# EAGLE design controler_bot_3_52 (EAGLE 5.04)
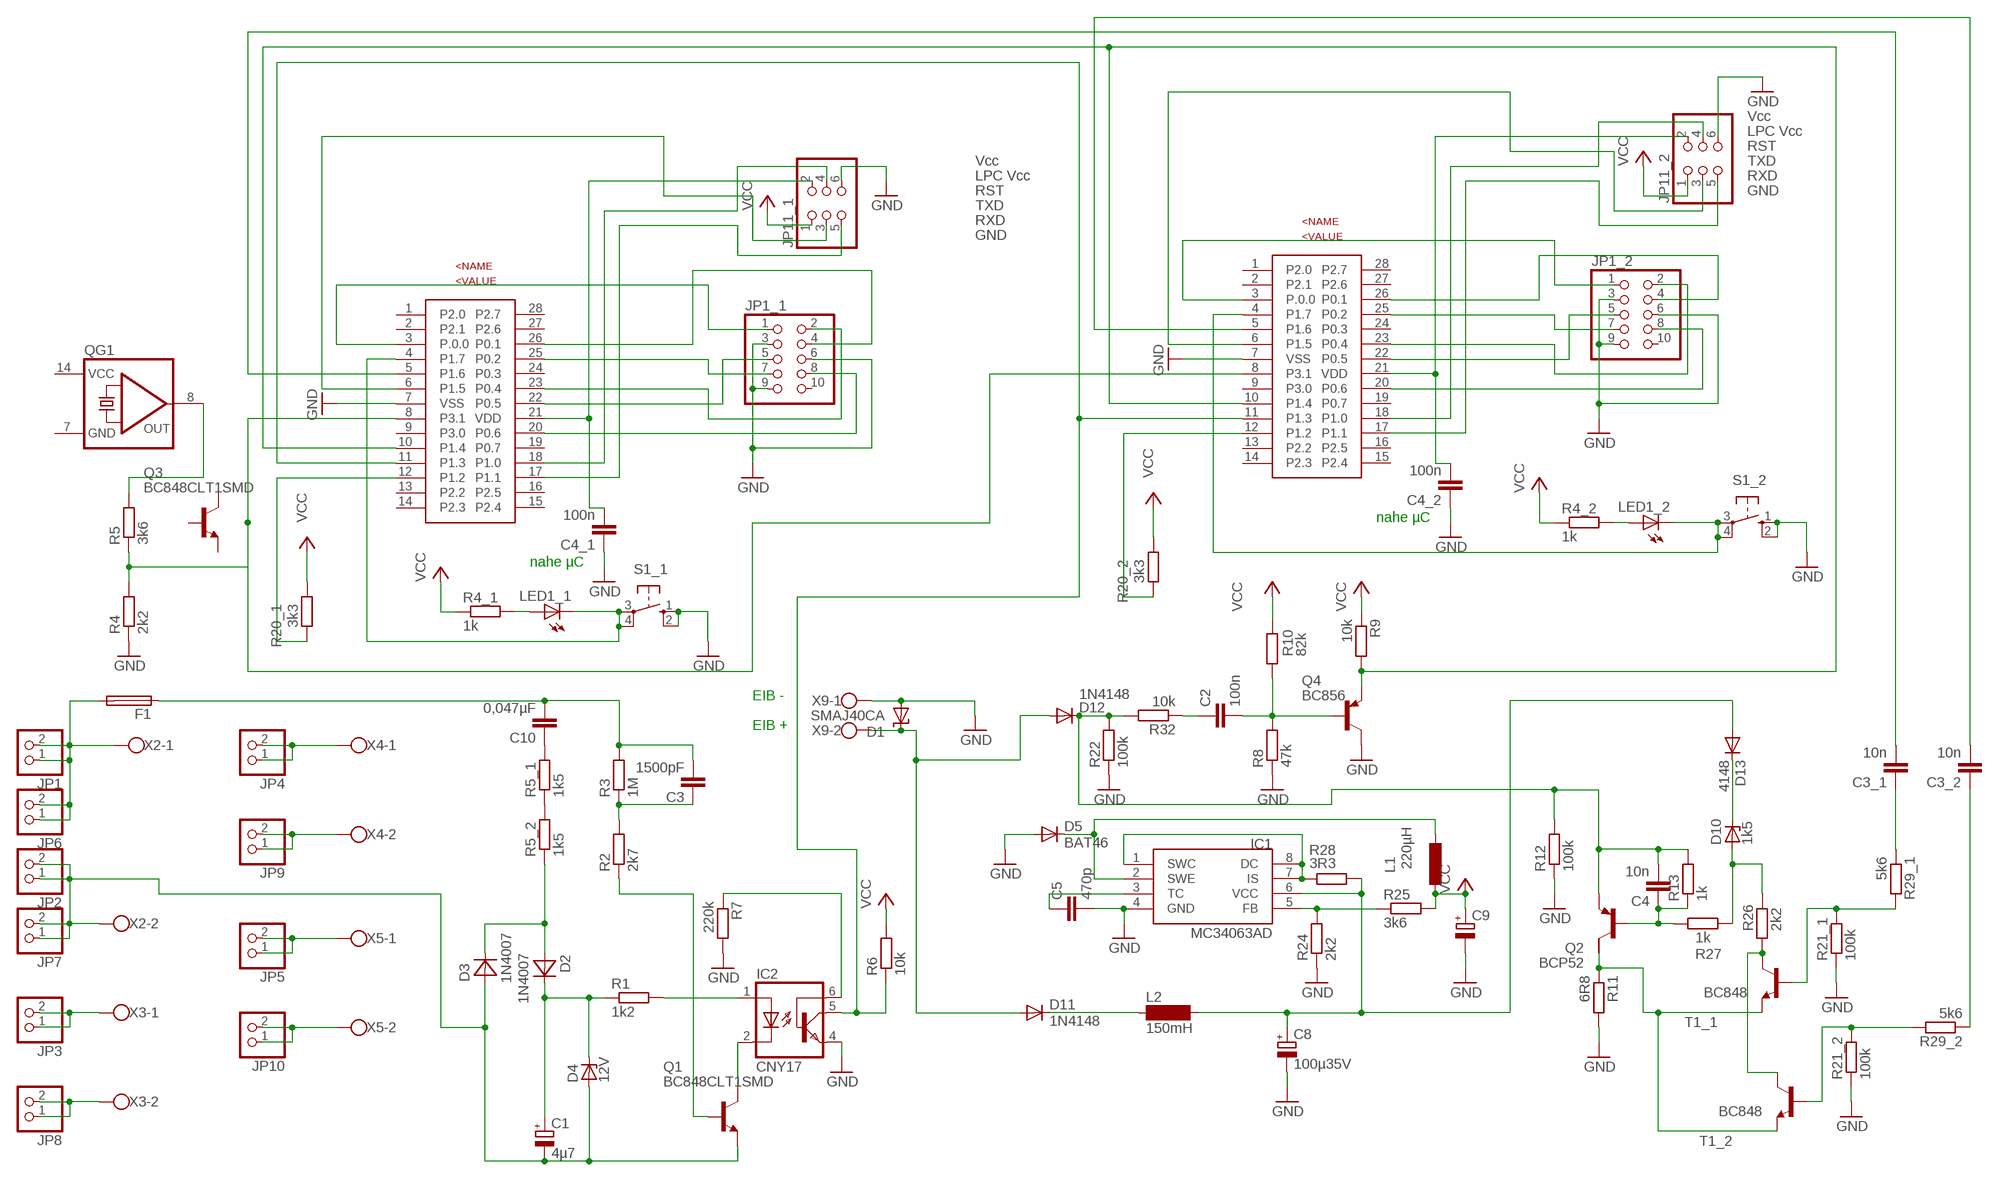
[diagram p0: schematic, sheet 1]

## Parts
C1  4µ7  CPOL-EUE2-5  [E2-5]
C2  100n  C-EUC1206  [C1206]
C3  1500pF  C-EU102-043X133  [C102-043X133]
C3_1  10n  C-EUC1206  [C1206]
C3_2  10n  C-EUC1206  [C1206]
C4  10n  C-EUC1206  [C1206]
C4_1  100n  C-EUC1206  [C1206]
C4_2  100n  C-EUC1206  [C1206]
C5  470p  C-EUC1206  [C1206]
C8  100µ35V  CPOL-EUE3.5-8  [E3,5-8]
C9  CPOL-EUE2.5-5  [E2,5-5]
C10  0,047µF  C-EU102-064X133  [C102-064X133]
D1  SMAJ40CA  SUPPRESSOR-SMBJ  [SMBJ]
D2  1N4007  [DO41-7]
D3  1N4007  [DO41-7]
D4  12V  ZENER-DIODESMB  [SMB]
D5  BAT46  DIODE-MINIMELF  [MINIMELF]
D10  1k5  ZPD  [MINIMELF]
D11  1N4148  DIODE-MINIMELF  [MINIMELF]
D12  1N4148  DIODE-MINIMELF  [MINIMELF]
D13  4148  DIODE-MINIMELF  [MINIMELF]
F1  19560  [19560]
IC1  MC34063AD  [SOIC8]
IC2  CNY17  [DIL06]
JP1  PINHD-1X2  [1X02]
JP1_1  PINHD-2X5  [2X05]
JP1_2  PINHD-2X5  [2X05]
JP2  PINHD-1X2  [1X02]
JP3  PINHD-1X2  [1X02]
JP4  PINHD-1X2  [1X02]
JP5  PINHD-1X2  [1X02]
JP6  PINHD-1X2  [1X02]
JP7  PINHD-1X2  [1X02]
JP8  PINHD-1X2  [1X02]
JP9  PINHD-1X2  [1X02]
JP10  PINHD-1X2  [1X02]
JP11_1  PINHD-2X3  [2X03]
JP11_2  PINHD-2X3  [2X03]
L1  220µH  L-EU2200-11.43  [2200-11.43]
L2  150mH  BS11  [BS11]
LED1_1  LED3MM  [LED3MM]
LED1_2  LED3MM  [LED3MM]
Q1  BC848CLT1SMD  [SOT23]
Q2  BCP52  FZT753SMD  [SOT223]
Q3  BC848CLT1SMD  [SOT23]
Q4  BC856  BC856ALT1SMD  [SOT23-BEC]
QG1  QG5860  [DIL14S]
R1  1k2  R-EU_R1206  [R1206]
R2  2k7  R-EU_0207/10  [0207/10]
R3  1M  R-EU_0207/7  [0207/7]
R4  2k2  R-EU_R1206  [R1206]
R4_1  1k  R-EU_R1206  [R1206]
R4_2  1k  R-EU_R1206  [R1206]
R5  3k6  R-EU_M1206  [M1206]
R5_1  1k5  R-EU_R1206  [R1206]
R5_2  1k5  R-EU_R1206  [R1206]
R6  10k  R-EU_R1206  [R1206]
R7  220k  R-EU_R1206  [R1206]
R8  47k  R-EU_M1206  [M1206]
R9  10k  R-EU_R1206  [R1206]
R10  82k  R-EU_R1206  [R1206]
R11  6R8  R-EU_R1206  [R1206]
R12  100k  R-EU_M1206  [M1206]
R13  1k  R-EU_R1206  [R1206]
R20_1  3k3  R-EU_M1206  [M1206]
R20_2  3k3  R-EU_M1206  [M1206]
R21_1  100k  R-EU_R1206  [R1206]
R21_2  100k  R-EU_R1206  [R1206]
R22  100k  R-EU_M1206  [M1206]
R24  2k2  R-EU_R1206  [R1206]
R25  3k6  R-EU_M1206  [M1206]
R26  2k2  R-EU_M1206  [M1206]
R27  1k  R-EU_R1206  [R1206]
R28  3R3  R-EU_M1206  [M1206]
R29_1  5k6  R-EU_R1206  [R1206]
R29_2  5k6  R-EU_R1206  [R1206]
R32  10k  R-EU_R1206  [R1206]
S1_1  10-XX  [B3F-10XX]
S1_2  10-XX  [B3F-10XX]
T1_1  BC848  [SOT23]
T1_2  BC848  [SOT23]
U1_1  LPC936TSSOP28  [TSSOP28]
U1_2  LPC936TSSOP28  [TSSOP28]
X2  W237-02P  [W237-132]
X3  W237-02P  [W237-132]
X4  W237-02P  [W237-132]
X5  W237-02P  [W237-132]
X9  W237-102  [W237-102]

## Nets
DRAIN: R26.1 T1_1.3(C) T1_2.3(C)
EIB+: D1.C D11.A D12.A X9.2
EIB_DC: C8.+ D13.A IC1.6(VCC) L2.2 R28.2
EIBIN: Q4.E R9.2 U1_1.10(P1.4) U1_2.10(P1.4)
GATE: R21_1.2 R29_1.2 T1_1.1(B)
GATE1: R21_2.2 R29_2.2 T1_2.1(B)
GND: C4_1.1 C4_2.1 C5.2 C8.- C9.- D1.A D5.A IC1.4(GND) IC2.4(EMI) JP1_1.3 JP1_1.6 JP1_1.9 JP1_2.3 JP1_2.6 JP1_2.9 JP11_1.6 JP11_2.6 Q4.C R4.1 R7.2 R8.1 R11.2 R12.1 R21_1.1 R21_2.1 R22.1 R24.1 S1_1.1(S) S1_1.2(S1) S1_2.1(S) S1_2.2(S1) U1_1.7(VSS) U1_2.7(VSS) X9.1
N$1: F1.2 JP1.1 JP1.2 JP6.1 JP6.2 X2.1
N$2: C1.- D3.A D4.A JP2.1 JP2.2 JP7.1 JP7.2 Q1.2(E) X2.2
N$3: JP4.1 JP4.2 X4.1
N$4: D11.C L2.1
N$5: LED1_2.A R4_2.2
N$6: C4.2 D12.C Q2.3(E) R12.2 R13.2 R22.2 R32.2
N$7: JP9.1 JP9.2 X4.2
N$8: JP5.1 JP5.2 X5.1
N$9: JP10.1 JP10.2 X5.2
N$10: C10.1 R5_1.2
N$11: C1.+ D2.C D4.C R1.1
N$12: LED1_1.A R4_1.2
N$13: IC2.1(A) R1.2
N$14: IC2.2(C) Q1.3(C)
N$15: C3.1 R2.2 R3.1
N$16: QG1.8(OUT) R5.2
N$17: R5_1.1 R5_2.2
N$18: C4.1 Q2.1(B) R13.1 R27.2
N$19: R4.2 R5.1 U1_1.8(P3.1) U1_2.8(P3.1)
N$20: IC2.5(COL) R6.1 U1_1.11(P1.3) U1_2.11(P1.3)
N$21: JP3.1 JP3.2 X3.1
N$22: JP8.1 JP8.2 X3.2
N$23: C3_1.1 R29_1.1
N$24: Q2.2(C) R11.1 T1_1.2(E) T1_2.2(E)
N$25: C3.2 C10.2 F1.1 R3.2
N$26: C3_2.1 R29_2.1
N$27: C3_1.2 U1_1.5(P1.6)
N$28: C3_2.2 U1_2.5(P1.6)
N$29: JP11_2.5 U1_2.17(P1.1)
N$30: JP11_2.4 U1_2.18(P1.0)
N$31: C2.2 Q4.B R8.2 R10.1
N$32: D2.A D3.C R5_2.1
N$33: IC2.6(BAS) R7.1
N$34: Q1.1(B) R2.1
N$41: JP11_1.5 U1_1.17(P1.1)
N$43: JP11_1.4 U1_1.18(P1.0)
N$50: IC1.5(FB) R24.2 R25.1
N$51: D5.C IC1.2(SWE) L1.2
N$52: C5.1 IC1.3(TC)
N$55: D10.A R26.2 R27.1
N$58: D10.C D13.C
N$63: IC1.1(SWC) IC1.7(IS) IC1.8(DC) R28.1
N$77: C2.1 R32.1
P0.0: JP1_1.1 U1_1.3(P.0.0)
P0.1: JP1_1.4 U1_1.26(P0.1)
P0.2: JP1_1.7 U1_1.25(P0.2)
P0.3: JP1_2.1 U1_2.3(P.0.0)
P0.4: JP1_1.2 U1_1.23(P0.4)
P0.5: JP1_2.4 U1_2.26(P0.1)
P0.6: JP1_1.8 U1_1.20(P0.6)
P0.7: JP1_2.7 U1_2.25(P0.2)
P0.8: JP1_2.2 U1_2.23(P0.4)
P0.9: JP1_2.8 U1_2.20(P0.6)
P0_1: JP1_2.5 U1_2.22(P0.5)
P0_5: JP1_1.5 U1_1.22(P0.5)
PROG_1: LED1_1.K(C) S1_1.3(P) S1_1.4(P1) U1_1.4(P1.7)
PROG_2: LED1_2.K(C) S1_2.3(P) S1_2.4(P1) U1_2.4(P1.7)
PWM_1: R20_1.2 U1_1.12(P1.2)
PWM_2: R20_2.2 U1_2.12(P1.2)
RST: JP11_1.3 U1_1.6(P1.5)
RST1: JP11_2.3 U1_2.6(P1.5)
VCC: C9.+ JP11_1.1 JP11_2.1 L1.1 R4_1.1 R4_2.1 R6.2 R9.1 R10.2 R20_1.1 R20_2.1 R25.2
VCC_LPC: C4_1.2 JP11_1.2 U1_1.21(VDD)
VCC_LPC1: C4_2.2 JP11_2.2 U1_2.21(VDD)
Unconnected: JP1_1.10 JP1_2.10 Q2.4(C/) Q3.1(B) Q3.2(E) Q3.3(C) U1_1.1(P2.0) U1_1.2(P2.1) U1_1.9(P3.0) U1_1.13(P2.2) U1_1.14(P2.3) U1_1.15(P2.4) U1_1.16(P2.5) U1_1.19(P0.7) U1_1.24(P0.3) U1_1.27(P2.6) U1_1.28(P2.7) U1_2.1(P2.0) U1_2.2(P2.1) U1_2.9(P3.0) U1_2.13(P2.2) U1_2.14(P2.3) U1_2.15(P2.4) U1_2.16(P2.5) U1_2.19(P0.7) U1_2.24(P0.3) U1_2.27(P2.6) U1_2.28(P2.7)

## Notes on the sheet
- Vcc
- LPC Vcc
- RST
- Vcc | TXD
- LPC Vcc | RXD
- RST | GND
- TXD
- RXD
- GND
- nahe µC
- nahe µC
- EIB -
- EIB +

## Power pins joined to a net without a drawn wire
GND: QG1.7(GND)
VCC: QG1.14(VCC)

## Library data of the parts
C1 C8 C9 = rcl:CPOL-EU: POLARIZED CAPACITOR, European symbol
C2 C3 C3_1 C3_2 C4 C4_1 C4_2 C5 C10 = rcl:C-EU: CAPACITOR, European symbol
D1 = diode:SUPPRESSOR-: Suppressor diode
D2 D3 = diode:1N4007
D4 = diode:ZENER-DIODE: Z-Diode
D5 D11-D13 = diode:DIODE-: DIODE
D10 = diode:ZPD: Z DIODE 500 mW
F1 = fuse:19560: FUSE HOLDER TR5, Wickmann
IC1 = mc34063:MC34063
IC2 = optocoupler:CNY17: SIEMENS OPTO COUPLER
JP1-JP10 = pinhead:PINHD-1X2: PIN HEADER
JP1_1 JP1_2 = pinhead:PINHD-2X5: PIN HEADER
JP11_1 JP11_2 = pinhead:PINHD-2X3: PIN HEADER
L1 = rcl:L-EU: INDUCTOR, European symbol
L2 = inductor-neosid:BS: INDUCTOR nominal inductance, magnetically screened
LED1_1 LED1_2 = led:LED: LED OSRAM: - CHIPLED LG R971, LG N971, LY N971, LG Q971, LY Q971, LO R971, LY R971 LH N974, LH R974 LS Q976, LO Q976, LY Q976 LO Q996 - Hyper CHIPLED LW Q18S LB Q993, LB Q99A, LB R99A - SideLED LS A670, LO A670, LY A670, LG A670, LP A670 LB A673, LV A673, LT A673, LW A673 LH A674 LY A675 LS A676, LA A676, LO A676, LY A676, LW A676 LS A679, LY A679, LG A679 - Hyper Micro SIDELED® LS Y876, LA Y876, LO Y876, LY Y876 LT Y87S - SmartLED LW L88C, LW L88S LB L89C, LB L89S, LG L890 LS L89K, LO L89K, LY L89K LS L896, LA L896, LO L896, LY L896 - TOPLED LS T670, LO T670, LY T670, LG T670, LP T670 LSG T670, LSP T670, LSY T670, LOP T670, LYG T670 LG T671, LOG T671, LSG T671 LB T673, LV T673, LT T673, LW T673 LH T674 LS T676, LA T676, LO T676, LY T676, LB T676, LH T676, LSB T676, LW T676 LB T67C, LV T67C, LT T67C, LS T67K, LO T67K, LY T67K, LW E67C LS E67B, LA E67B, LO E67B, LY E67B, LB E67C, LV E67C, LT E67C LW T67C LS T679, LY T679, LG T679 LS T770, LO T770, LY T770, LG T770, LP T770 LB T773, LV T773, LT T773, LW T773 LH T774 LS E675, LA E675, LY E675, LS T675 LS T776, LA T776, LO T776, LY T776, LB T776 LHGB T686 LT T68C, LB T68C - Hyper Mini TOPLED® LB M676 - Mini TOPLED Santana® LG M470 LS M47K, LO M47K, LY M47K Source: http://www.osram.convergy.de - LUMILED® LXK2-PW12-R00, LXK2-PW12-S00, LXK2-PW14-U00, LXK2-PW14-V00 LXK2-PM12-R00, LXK2-PM12-S00, LXK2-PM14-U00 LXK2-PE12-Q00, LXK2-PE12-R00, LXK2-PE12-S00, LXK2-PE14-T00, LXK2-PE14-U00 LXK2-PB12-K00, LXK2-PB12-L00, LXK2-PB12-M00, LXK2-PB14-N00, LXK2-PB14-P00, LXK2-PB14-Q00 LXK2-PR12-L00, LXK2-PR12-M00, LXK2-PR14-Q00, LXK2-PR14-R00 LXK2-PD12-Q00, LXK2-PD12-R00, LXK2-PD12-S00 LXK2-PH12-R00, LXK2-PH12-S00 LXK2-PL12-P00, LXK2-PL12-Q00, LXK2-PL12-R00 Source: www.luxeon.com
Q1 Q3 = transistor-npn:BC848*: NPN Transistor
Q2 = transistor-pnp:FZT753SMD: PNP Transistor
Q4 = transistor-pnp:BC856*: PNP Transistror
QG1 = crystal:QG5860: CRYSTAL RESONATOR
R1-R4 R4_1 R4_2 R5 R5_1 R5_2 R6-R13 R20_1 R20_2 R21_1 R21_2 R22 R24-R28 R29_1 R29_2 R32 = rcl:R-EU_: RESISTOR, European symbol
S1_1 S1_2 = switch-omron:10-XX: OMRON SWITCH
T1_1 T1_2 = transistor:BC848: NPN TRANSISTOR
U1_1 U1_2 = freebuslpc:LPC936: C51 Based Microcontroller LPC936 ADC and 16kbyte Flash
X2-X5 = con-wago-508:W237-02P: WAGO SREW CLAMP
X9 = con-wago-500:W237-102: WAGO SCREW CLAMP

## Board
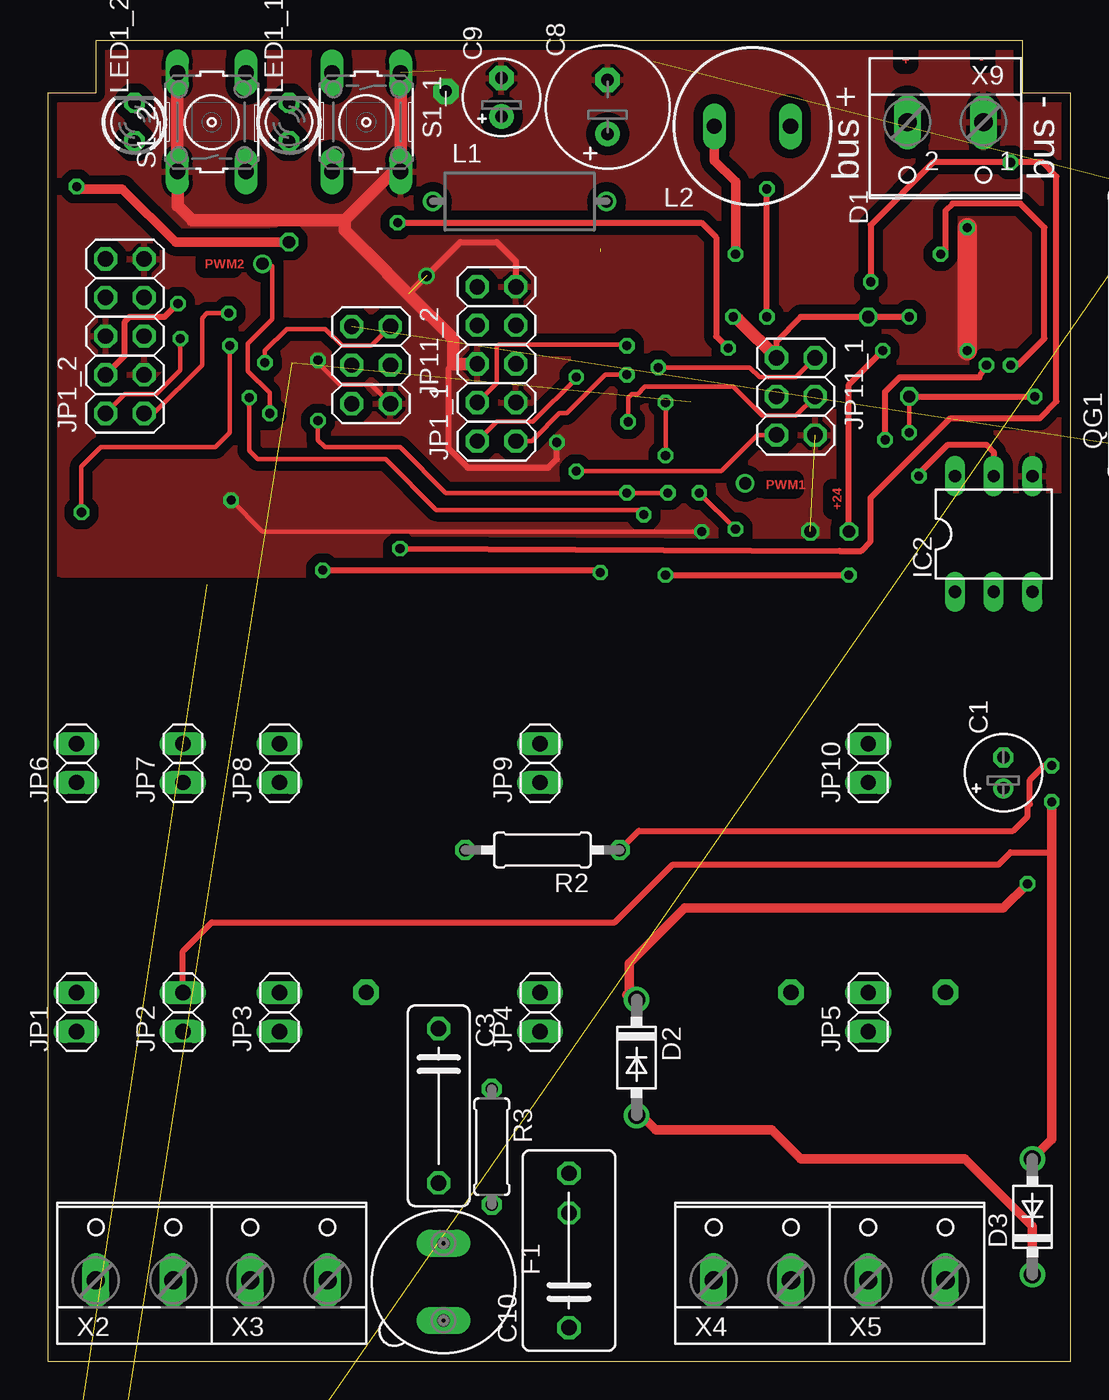
[diagram p1: board, top side]
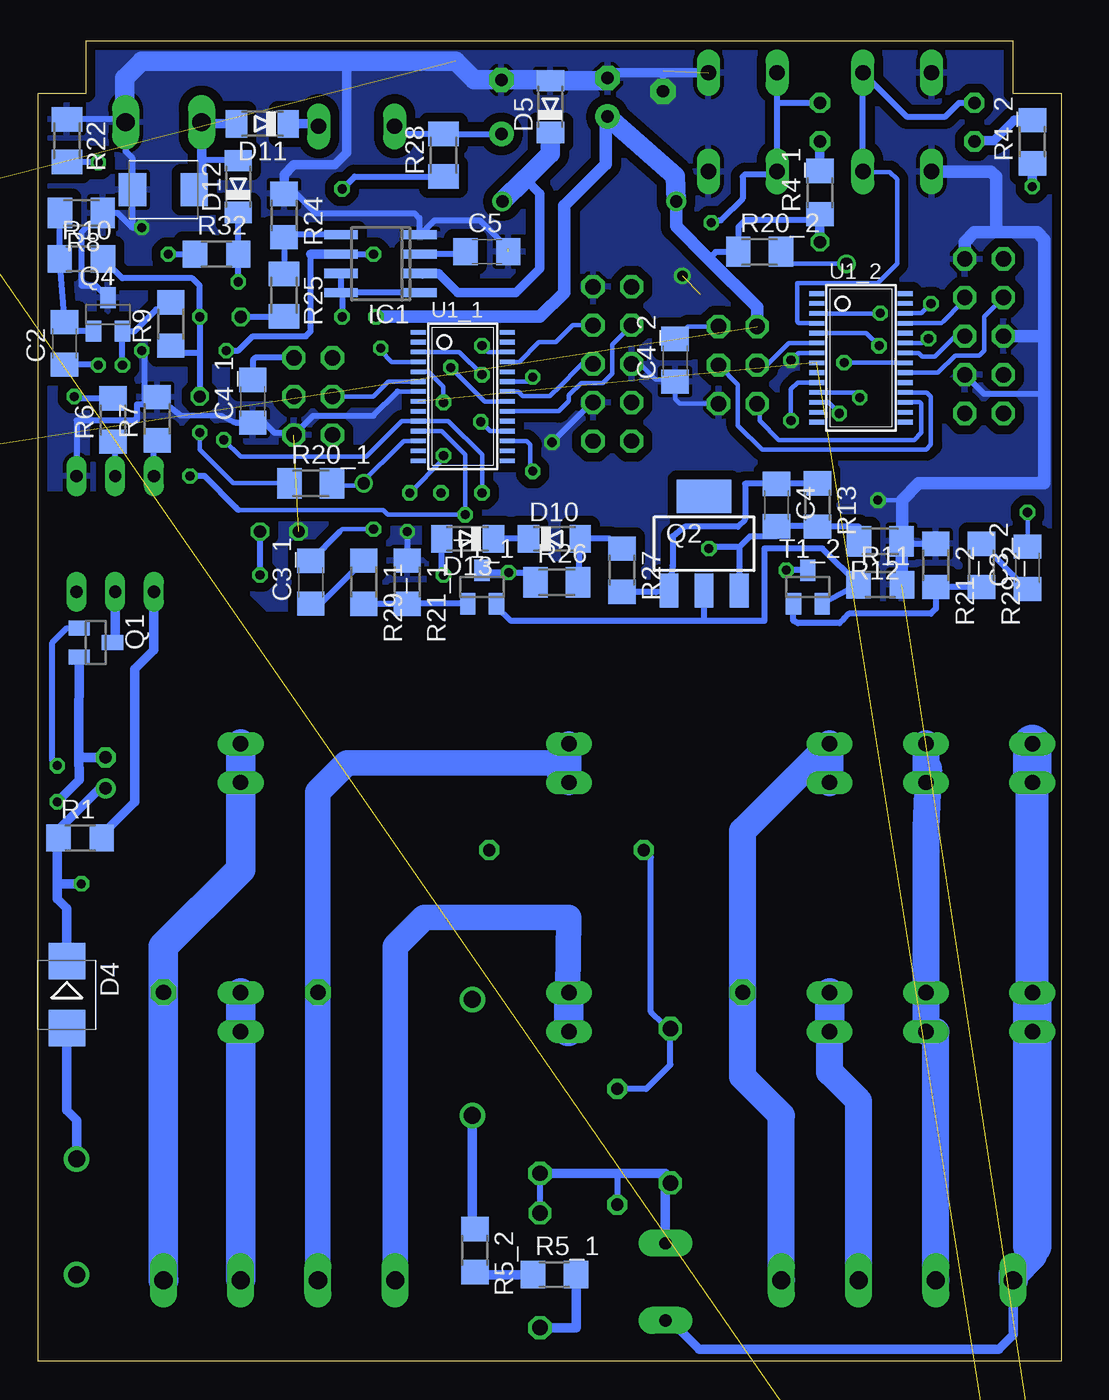
[diagram p2: board, bottom side, seen from below]

Size 67.31 x 86.9 mm. Coordinates in mm from the lower left corner, seen from the top.
Outline: 67.3,0 67.31,83.45 64.13,83.45 64.13,86.9 3.18,86.9 3.18,83.45 0,83.45 0,0 67.3,0
Copper layers (1*16): Top 0.035mm / dielectric 1.5mm / Bottom 0.035mm
Design rules "default *": minimum track width 10mil, minimum drill 12mil, track to track 8mil, track to pad 8mil, pad to pad 16mil, via to via 16mil, smd to smd 4mil, copper to edge 12mil, drill to drill 10mil, minimum pad ring 10mil, minimum via ring 8mil, stop-mask expansion 4mil, vias tented up to drill 0mil, thermal gap 10mil
tKeepout: area 0.3,25.6 to 67,27.1; area 43.2,27.3 to 49.4,38.1; area 27.8,27.1 to 39.1,30; area 16.2,27.3 to 25.7,40.2; area 0.2,42.1 to 66.8,43.7; area 43,43.8 to 49.2,54.6; area 27.6,43.7 to 38.9,46.5; area 16,43.8 to 25.6,56.7
tRestrict: area 31.9,17.4 to 34.9,20.4
bRestrict: area 0,41.9 to 58.4,47

### Footprints (pad centres in the part's own frame; a part is rotated, then mirrored left to right if it is on the bottom)
E2-5 = drill 0.813 pad 1.27 round: + -1.016,0 | drill 0.813 pad 1.27 octagon: - 1.016,0
C1206 = smd 1.6 x 1.8: 1 -1.4,0; 2 1.4,0
C102-043X133 = drill 1.016 octagon: 1 -5.08,0; 2 5.08,0
E3,5-8 = drill 0.813 pad 1.6 round: + -1.778,0 | drill 0.813 pad 1.6 octagon: - 1.778,0
E2,5-5 = drill 0.813 pad 1.6 round: + -1.27,0 | drill 0.813 pad 1.6 octagon: - 1.27,0
C102-064X133 = drill 1.016 octagon: 1 -5.08,0; 2 5.08,0
SMBJ = smd 1.78 x 2.16: A 2.04,0; C -2.03,0
DO41-7 = drill 1.118 round: A 3.81,0; C -3.81,0
SMB = smd 2.4 x 2.4: A 2.2,0; C -2.2,0
MINIMELF = smd 1.4 x 1.8: A 1.7,0; C -1.7,0
19560 = drill 0.813 pad 1.778 long: 1 -2.54,0; 2 2.54,0
SOIC8 = smd 0.6 x 2.2: 1 -1.905,-2.6; 2 -0.635,-2.6; 3 0.635,-2.6; 4 1.905,-2.6; 5 1.905,2.6; 6 0.635,2.6; 7 -0.635,2.6; 8 -1.905,2.6
DIL06 = drill 0.813 long: 1 -2.54,-3.81; 2 0,-3.81; 3 2.54,-3.81; 4 2.54,3.81; 5 0,3.81; 6 -2.54,3.81
1X02 = drill 1.016 long: 1 -1.27,0; 2 1.27,0
2X05 = drill 1.016 octagon: 1 -5.08,-1.27; 2 -5.08,1.27; 3 -2.54,-1.27; 4 -2.54,1.27; 5 0,-1.27; 6 0,1.27; 7 2.54,-1.27; 8 2.54,1.27; 9 5.08,-1.27; 10 5.08,1.27
2X03 = drill 1.016 octagon: 1 -2.54,-1.27; 2 -2.54,1.27; 3 0,-1.27; 4 0,1.27; 5 2.54,-1.27; 6 2.54,1.27
2200-11.43 = drill 0.8 pad 1.27 round: 1 -5.715,0; 2 5.715,0
BS11 = drill 1 long: 1 -2.5,0; 2 2.5,0
LED3MM = drill 0.813 octagon: A -1.27,0; K 1.27,0
SOT23 = smd 1 x 1.4: 1 -0.95,-1.1; 2 0.95,-1.1; 3 0,1.1
SOT223 = smd 1.219 x 2.235: 1 -2.311,-3.099; 2 0,-3.099; 3 2.311,-3.099 | smd 3.6 x 2.2: 4 0,3.099
SOT23-BEC = smd 1 x 1.4: B -0.95,-1.1; C 0,1.1; E 0.95,-1.1
DIL14S = drill 0.813 round: 1 -7.62,-3.81; 7 7.62,-3.81; 8 7.62,3.81; 14 -7.62,3.81
R1206 = smd 1.6 x 1.803: 1 -1.422,0; 2 1.422,0
0207/10 = drill 0.813 octagon: 1 -5.08,0; 2 5.08,0
0207/7 = drill 0.813 octagon: 1 -3.81,0; 2 3.81,0
M1206 = smd 1.6 x 2: 1 -1.4,0; 2 1.4,0
B3F-10XX = drill 1.016 long: 1 -3.251,2.261; 2 3.251,2.261; 3 -3.251,-2.261; 4 3.251,-2.261
TSSOP28 = smd 0.305 x 0.991: 1 -4.225,-2.918; 2 -3.575,-2.918; 3 -2.925,-2.918; 4 -2.275,-2.918; 5 -1.625,-2.918; 6 -0.975,-2.918; 7 -0.325,-2.918; 8 0.325,-2.918; 9 0.975,-2.918; 10 1.625,-2.918; 11 2.275,-2.918; 12 2.925,-2.918; 13 3.575,-2.918; 14 4.225,-2.918; 15 4.225,2.918; 16 3.575,2.918; 17 2.925,2.918; 18 2.275,2.918; 19 1.625,2.918; 20 0.975,2.918; 21 0.325,2.918; 22 -0.325,2.918; 23 -0.975,2.918; 24 -1.625,2.918; 25 -2.275,2.918; 26 -2.925,2.918; 27 -3.575,2.918; 28 -4.225,2.918
W237-132 = drill 1.194 long: 1 -2.54,-0.635; 2 2.54,-0.635
W237-102 = drill 1.194 long: 1 -2.5,-1.27; 2 2.5,-1.27

### Placement (x,y rotation side)
C1  62.87,38.74 90 top
C2  65.56,66.99 90 bottom
C3  25.72,16.83 270 top
C3_1  49.37,51.28 90 bottom
C3_2  2.22,52.23 90 bottom
C4  18.73,56.36 270 bottom
C4_1  53.18,63.18 90 bottom
C4_2  25.4,65.88 90 bottom
C5  37.78,73.03 0 bottom
C8  36.83,82.55 90 top
C9  29.84,83.19 90 top
C10  34.29,7.3 90 top
D1  59.05,77.1 180 bottom
D2  38.73,20 270 top
D3  64.77,9.53 90 top
D4  65.41,24.13 270 bottom
D5  33.61,82.57 90 bottom
D10  33.34,54.13 0 bottom
D11  52.55,81.44 180 bottom
D12  54.13,77.31 90 bottom
D13  39.05,54.13 180 bottom
F1  26.04,5.24 270 top
IC1  44.77,72.23 90 bottom
IC2  62.23,54.45 0 top
JP1  1.91,22.99 90 top
JP1_1  29.53,65.64 90 top
JP1_2  5.08,67.47 90 top
JP2  8.89,22.99 90 top
JP3  15.24,22.99 90 top
JP4  32.38,22.99 90 top
JP5  53.98,22.99 90 top
JP6  1.91,39.37 90 top
JP7  8.89,39.37 90 top
JP8  15.24,39.37 90 top
JP9  32.38,39.37 90 top
JP10  53.98,39.37 90 top
JP11_1  49.21,63.5 270 top
JP11_2  21.27,65.56 270 top
L1  31.04,76.34 0 top
L2  46.35,81.28 180 top
LED1_1  15.87,81.55 90 top
LED1_2  5.71,81.55 90 top
Q1  63.5,47.31 270 bottom
Q2  23.5,53.82 0 bottom
Q3  1.27,-33.02 0 top  (outside the outline)
Q4  62.71,68.9 0 bottom
QG1  76.2,67.63 90 top  (outside the outline)
R1  64.53,34.45 0 bottom
R2  32.54,33.66 180 top
R3  29.21,14.13 270 top
R4  1.27,-19.05 0 top  (outside the outline)
R4_1  15.88,76.91 90 bottom
R4_2  1.91,80.26 90 bottom
R5  1.27,-25.4 0 top  (outside the outline)
R5_1  33.34,5.71 0 bottom
R5_2  38.58,7.3 270 bottom
R6  62.37,61.96 90 bottom
R7  59.46,62.03 90 bottom
R8  64.45,75.57 180 bottom
R9  58.58,68.26 90 bottom
R10  64.45,72.55 0 bottom
R11  11.91,51.12 0 bottom
R12  11.91,53.98 180 bottom
R13  16.03,56.36 270 bottom
R20_1  49.37,57.79 0 bottom
R20_2  19.84,73.02 0 bottom
R21_1  43.02,51.28 270 bottom
R21_2  8.26,52.39 270 bottom
R22  65.41,80.33 270 bottom
R24  51.12,75.41 270 bottom
R25  51.12,70.17 270 bottom
R26  33.18,51.28 0 bottom
R27  28.89,52.07 270 bottom
R28  40.64,79.38 90 bottom
R29_1  45.88,51.28 270 bottom
R29_2  5.24,52.39 270 bottom
R32  55.56,72.87 0 bottom
S1_1  20.95,81.55 270 top
S1_2  10.79,81.55 90 top
T1_1  38.1,50.96 0 bottom
T1_2  16.67,50.96 0 bottom
U1_1  39.37,63.5 270 bottom
U1_2  13.18,66.04 270 bottom
X2  5.71,5.98 0 top
X3  15.87,5.98 0 top
X4  46.35,5.98 0 top
X5  56.51,5.98 0 top
X9  59.05,80.28 180 top

### Tracks (layer width: path | path; a pad name or v marks a point on that pad's centre or on a via)
DRAIN  (via drill 0.6)
  Top 0.406: 36.2,52.07 v36.35,51.91 36.2,52.07 | v18.1,52.07 36.2,52.07
  Bottom 0.406: R26.1 35.38,51.9 37.94,51.9 | 37.94,51.9 T1_1.3 | T1_2.3 17,52.07 v18.1,52.07 | v36.35,51.91 37.94,51.9
EIB+
  Bottom 0.406: D12.A 54.18,79.06 56.55,79.06
  Bottom 0.61: D11.A 56.44,81.44 X9.2 56.55,79.06 56.55,77.58 D1.C 56.52,76.34
EIB_DC  (via drill 0.6, 0.8)
  Top 0.406: v40.64,51.75 v52.7,51.75 | v52.7,54.61 52.7,64.29 v54.93,66.52
  Top 0.61: L2.2 43.85,79.02 45.24,77.63 v45.24,72.87
  Bottom 0.406: C8.+ R28.2 43.35,80.77 L2.2 | IC1.6 v45.24,72.87 | D13.A 40.75,51.87 v40.64,51.75 | v52.7,51.75 v52.7,54.61 | v54.93,66.52 54.13,66.52 53.18,67.47 49.69,67.47 49.37,67.79 49.37,72.87
  Bottom 0.61: 49.37,72.87 IC1.6
EIBIN  (via drill 0.6)
  Top 0.305: v17.78,61.91 17.78,60.64 18.26,60.17 23.18,60.17 26.19,57.15 v38.1,57.15 v40.8,57.15
  Top 0.406: v55.09,60.64 55.09,63.82 56.04,64.77 61.28,64.77 v61.75,65.56
  Bottom 0.305: U1_2.10 17.34,64.42 17.78,63.98 v17.78,61.91 | 42.33,61.88 U1_1.10 | v38.1,57.15 38.1,59.69 40.32,61.88 42.33,61.88 | 42.33,61.88 43.37,61.88 45.72,59.53 53.98,59.53 v55.09,60.64
  Bottom 0.406: R9.2 59.05,69.21 59.53,69.21 60.95,67.8 Q4.E v61.75,65.56
GATE
  Bottom 0.406: T1_1.1 R21_1.2 R29_1.2 | R29_1.2
GATE1
  Bottom 0.406: 14.29,48.9 13.97,49.21 8.58,49.21 8.26,49.54 R21_2.2 R29_2.2 | 14.29,48.9 | 14.29,48.9 14.61,48.58 17.3,48.58 17.62,48.73 T1_2.1
GND  (via drill 0.6, 0.7, 0.8, 0.8 pad 1.68)  (6 unrouted)
  Top 0.305: v17.78,65.88 17.78,65.72 19.21,64.29 21.27,64.29 JP11_2.6 | v43.02,54.61 14.13,54.61 v12.06,56.67
  Top 0.406: JP1_1.9 30.8,72.39 29.53,73.66 27.15,73.66 23.73,70.25 | v33.5,60.48 33.5,59.37 32.94,58.82 27.62,58.82 26.35,60.09 26.35,65.33 26.67,65.64
  Top 0.61: S1_2.2 8.53,81.95 8.57,81.6
  Top 0.813: S1_2.2 S1_2.1 8.57,78.26 8.57,76.04 9.53,75.09 19.53,75.09 | S1_1.1 S1_1.2 22.74,78.3 19.53,75.09 | JP1_1.6 26.67,65.64 26.67,67.31 23.73,70.25 20.95,73.02 | 20.95,73.02 | 20.95,73.02 19.53,74.45 19.53,75.09
  Top 1.27: v60.48,74.61 v60.48,66.52
  Bottom 0.305: JP1_2.9 6.19,72.55 | U1_2.7 17.3,66.36 v17.78,65.88 | JP11_2.6 25.08,63.02 25.4,63.34 C4_2.1 25.53,64.61 26.67,64.61 27.7,65.64 JP1_1.6 | 43.65,63.83 U1_1.7 | 10.48,56.67 v12.06,56.67 | JP1_2.6
  Bottom 0.406: 60.33,62.98 R7.2 57.95,62.26 55.24,62.23 54.32,61.78 C4_1.1 52.42,61.78 51.75,61.12 50.64,61.12 JP11_1.6 49.21,62.23 45.24,62.23 43.65,63.83 | 60.33,62.98 60.8,62.98 60.8,61.91 64.77,61.91 IC2.4 | C9.- 29.55,84.75 | X9.1 61.55,79.65 61.12,79.22 61.12,77.13 D1.A 61.12,77.08 61.12,74.61 | R24.1 50.32,76.83 49.05,75.56 42.54,75.56 42.23,75.25 42.23,74.2 IC1.4 41.22,75.09 38.26,75.09 36.38,73.21 | 61.12,74.61 v60.48,74.61 | v60.48,66.52 60.33,66.52 60.33,62.98 | 61.12,74.61 62.07,75.56 R8.1 63.37,75.38 64.45,74.3 64.45,70.8 63.51,70.8 Q4.C | 61.59,81.59 61.73,81.73 R22.1 | 10.51,51.14 R11.2 | R12.1 | 8.26,53.98 R21_2.1 10.34,53.81 R12.1 | JP1_2.3 | JP1_2.3 5.08,63.66 1.11,63.66 | JP1_1.3 30.8,63.18 v33.5,60.48 | v43.02,54.61 R21_1.1 | v43.02,54.61 | v26.19,83.58 26.19,84.93
  Bottom 0.61: S1_1.1 29.5,84.8 C9.- | R24.1 51.12,78.1 50.48,78.74 47.78,78.74 46.99,79.53 46.99,85.41 47.15,85.57
  Bottom 0.813: 10.51,51.14 R12.1 10.48,54 10.48,56.67 9.37,57.79 1.11,57.79 1.11,63.66 1.11,67.63 | JP1_2.9 6.35,73.66 5.71,74.3 4.13,74.3 | 4.13,74.3 1.59,74.3 1.11,73.82 1.11,67.63 | S1_2.1 4.64,78.3 4.29,77.95 4.29,74.45 4.13,74.3 | JP1_2.6 1.27,67.47 1.11,67.63
  Bottom 1.27: X9.1 61.59,81.59 61.59,84.45 60.48,85.57 47.15,85.57 39.85,85.57 38.61,84.33 C8.- 33.66,84.33 D5.A 30.03,84.27 C9.-
  other vias: 24.92,71.44 50.16,54.61
  pour Bottom (isolate 0.61): -0.16,49.53 -0.16,84.93 2.22,87.31 64.61,87.31 68.1,83.82 68.1,58.9 66.67,57.47 56.2,57.47 53.5,54.77 53.5,50.8 52.23,49.53
  pour Top (isolate 0.61): -0.16,52.07 -0.48,83.66 3.02,87.15 64.29,87.15 68.1,83.34 68.1,57.94 67.47,57.31 55.25,57.31 54.13,56.2 53.98,52.55 51.75,51.75 0.95,51.75
N$1
  Bottom 0.406: JP1.2 1.91,30.8
  Bottom 0.61: F1.2 25.4,2.38 23.81,0.79 4.13,0.79 3.17,1.75 X2.1
  Bottom 1.93: 1.91,7.62 1.91,6.98 3.17,5.71 X2.1
  Bottom 2.184: JP1.2 JP6.1
  Bottom 2.54: JP6.1 JP6.2 | JP1.2 JP1.1 1.91,7.62
N$2  (via drill 0.6)
  Top 0.406: 66.04,33.5 63.34,33.5 62.55,32.7 41.12,32.7 37.31,28.89 10.79,28.89 8.89,26.99 JP2.2
  Top 0.61: v66.04,36.83 66.04,33.5 66.04,14.61 D3.A
  Bottom 0.61: D3.A 64.77,15.88 65.41,16.51 D4.A | Q1.2 64.61,40.96 64.61,40.01 | 64.61,40.01 64.61,38.26 v66.04,36.83 | C1.- 64.36,39.75 64.61,40.01
  Bottom 1.778: JP7.2 JP7.1 8.73,39.05 8.89,35.08 JP2.2 JP2.1 8.25,21.72 X2.2
N$3
  Bottom 0.61: 32.51,22.1 32.51,21.59
  Bottom 1.676: X4.1 43.81,27.31 41.91,29.21 32.38,29.21 32.51,22.1 | 32.51,21.59 JP4.1
  Bottom 1.93: JP4.1 JP4.2
N$4
  Bottom 0.61: D11.C 49.01,81.44 L2.1
N$5
  Bottom 0.61: R4_2.2 3.09,81.68 4.45,80.33 5.67,80.33 LED1_2.A
N$6  (via drill 0.6)
  Top 0.406: v23.18,53.5 52.07,53.34 53.5,53.34 54.13,53.98 54.13,56.83 59.37,62.07 65.25,62.07 66.36,63.18 66.36,77.97 R22.2 63.37,78.93 v63.34,78.9 58.26,78.9 54.13,74.77 v54.13,71.04
  Bottom 0.406: D12.C R32.2 v54.13,71.04 | R22.2 65.38,78.9 v63.34,78.9 | 21.18,53.59 Q2.3 | 21.18,53.59 20.48,54.29 18.73,54.29 C4.2 16.03,54.96 R13.2 13.31,54.93 R12.2 | 21.18,53.59 23.11,53.59 v23.18,53.5
N$7  (via drill 1 pad 1.68)
  Bottom 0.406: v48.9,24.29 v48.89,24.29 48.89,24.37
  Bottom 1.676: X4.2 48.89,24.37 48.89,37.47 46.99,39.37 33.02,39.37 33.02,38.74 JP9.1 JP9.2
N$8
  Bottom 0.406: X5.1 53.97,5.39 53.98,5.4
  Bottom 1.93: JP5.2 JP5.1 53.98,5.4
N$9  (via drill 1 pad 1.68)
  Bottom 1.93: JP10.2 JP10.1 53.98,32.38 59.05,27.3 v59.05,24.29 X5.2
N$10
  Bottom 0.61: C10.1 31.91,2.22 R5_1.2
N$11  (via drill 0.6)
  Top 0.61: v64.45,31.43 62.87,29.84 41.91,29.84 38.26,26.19 38.26,24.29 38.1,24.13 D2.C
  Bottom 0.61: C1.+ 63.25,37.72 66.04,34.93 | 66.04,31.43 66.04,30.45 65.41,29.82 D4.C | 66.04,31.43 66.04,34.93 | v64.45,31.43 66.04,31.43 | 66.04,34.93 66.04,34.54 R1.1
N$12
  Bottom 0.61: LED1_1.A R4_1.2
N$13
  Bottom 0.61: 63.26,34.53 60.96,36.83 60.96,45.56 59.69,46.83 IC2.1 | 63.26,34.53 63.5,34.29 | R1.2 63.18,34.45 63.26,34.53
N$14
  Bottom 0.61: IC2.2 62.23,47.78 Q1.3
N$15
  Bottom 0.406: R2.2 26.99,33.18 26.99,23.02 26.19,22.22 25.72,21.59 C3.1 | C3.1 | R3.1 27.3,17.94 25.72,19.53 C3.1 | C3.1
N$16  (1 unrouted)
N$17
  Bottom 0.61: R5_1.1 38.58,5.71 R5_2.2
N$18
  Bottom 0.406: R13.1 18.73,57.78 C4.1 20.8,57.76 20.8,55.4 21.27,54.93 24.77,54.93 25.56,54.29 25.56,52.38 Q2.1 26.67,50.63 28.87,50.63 R27.2
N$19  (3 unrouted)
N$20  (via drill 0.6)
  Top 0.305: v39.21,55.72 39.21,56.04 38.89,56.04 38.26,56.04 25.56,56.04 22.23,59.37 13.81,59.37 13.26,59.93 v13.26,63.42
  Top 0.406: v57.31,58.26 57.31,58.42 59.21,60.33 61.75,60.33 62.23,59.85 IC2.5
  Bottom 0.305: U1_2.11 13.55,63.77 v13.26,63.42 | 54.13,56.04 44.61,56.04 44.29,55.72 v39.21,55.72 39.21,59.69 40.75,61.23 U1_1.11
  Bottom 0.406: 54.13,56.04 54.29,56.2 56.36,58.26 v57.31,58.26 | R6.1 62.23,60.22 IC2.5
N$21
  Bottom 1.778: JP3.1 15.24,19.05 13.34,17.14 X3.1
  Bottom 1.93: JP3.1 JP3.2
N$22  (via drill 1 pad 1.68)
  Bottom 1.778: JP8.2 JP8.1 JP8.2 | JP8.2 20.95,34.93 v20.95,24.29 20.95,18.73 18.41,16.19 X3.2
N$23
  Bottom 0.406: C3_1.1 48.7,49.88 R29_1.1
N$24
  Bottom 0.406: T1_2.2 13.35,51.12 R11.1 15.71,53.5 18.26,53.5 19.37,53.5 19.53,53.5 19.53,48.74 23.5,48.74 | 23.5,48.74 Q2.2 | T1_1.2 37.15,49.69 36.2,48.74 23.5,48.74
N$25  (via drill 1)
  Bottom 0.406: C10.2 v34.29,9.76 | R3.2 | 29.21,12.38 R3.2 | C3.2 25.88,11.91 26.04,11.91
  Bottom 0.61: F1.1 26.04,11.91 26.04,12.38 29.21,12.38 C10.2
N$26
  Bottom 0.406: C3_2.1 2.26,50.83 R29_2.1
N$27  (via drill 0.6)
  Top 0.305: v40.64,63.1 40.64,60.96 v40.64,59.61 | v42.86,57.15 v45.24,54.77
  Bottom 0.305: U1_1.5 41.63,65.12 40.64,64.14 v40.64,63.1 | v40.64,59.61 40.64,59.37 v42.86,57.15 | v45.24,54.77 47.31,54.77 47.47,54.61
  Bottom 0.406: 47.47,54.61 C3_1.2
N$28  (via drill 0.6)
  Top 0.305: v11.99,66.83 11.99,61.12 11.03,60.17 3.49,60.17 2.22,58.9 v2.22,55.88
  Bottom 0.305: U1_2.5 12.82,67.66 v11.99,66.83 | C3_2.2 v2.22,55.88
N$29
  Bottom 0.305: U1_2.17 9.3,63.12 9.21,63.02 9.21,61.12 9.68,60.64 18.57,60.64 19.84,61.91 19.84,62.87 JP11_2.5
N$30
  Bottom 0.305: U1_2.18 8.84,63.77 8.57,63.5 8.57,60.33 8.89,60.01 19.68,60.01 21.27,61.6 21.27,64.29 JP11_2.4
N$31
  Bottom 0.406: R8.2 65.87,75.27 R10.1 65.88,72.54 C2.2 65.29,67.8 Q4.B
N$32
  Top 0.61: D3.C 64.77,8.89 60.33,13.33 49.53,13.33 47.62,15.24 40.01,15.24 38.73,16.51 D2.A
  Bottom 0.61: R5_2.1 38.73,8.88 D2.A
N$33
  Bottom 0.406: R7.1 59.69,60.61 IC2.6
N$34  (via drill 0.6)
  Top 0.406: R2.1 38.89,34.93 63.5,34.93 64.45,35.88 64.45,36.51 64.61,36.67 64.61,38.26 65.56,39.21 v66.04,39.21
  Bottom 0.406: v66.04,39.21 66.36,39.53 66.36,47.31 65.41,48.26 Q1.1
N$41  (via drill 0.6)
  Top 0.305: v34.77,58.58 44.29,58.58 46.67,60.96 JP11_1.5
  Bottom 0.305: U1_1.17 35.17,60.58 34.92,60.33 34.92,58.74 v34.77,58.58
N$43  (via drill 0.6)
  Top 0.305: v38.18,61.83 38.18,63.42 38.42,63.66 38.81,63.66 39.29,64.14 45.09,64.14 46.99,62.23 49.21,62.23 JP11_1.4
  Bottom 0.305: U1_1.18 37.57,61.23 v38.18,61.83
N$50
  Bottom 0.406: R25.1 R24.2 50.97,74.14 IC1.5
N$51
  Bottom 0.406: IC1.2 42.01,71.44
  Bottom 0.61: IC1.2 40.96,71.6 39.69,70.33 35.88,70.33 34.29,71.91 34.29,76.83 35.27,77.82
  Bottom 1.27: D5.C 33.61,79.49 35.27,77.82 L1.2
N$52
  Bottom 0.406: IC1.3 39.34,72.87 C5.1
N$55
  Bottom 0.406: R26.2 31.8,51.14 D10.A 29.69,54.13 29.04,53.49 R27.1
N$58
  Bottom 0.406: D10.C D13.C
N$63  (via drill 0.6)
  Top 0.406: v47.31,68.74 v47.31,77.15
  Bottom 0.406: IC1.1 IC1.8 | IC1.8 IC1.7 | R28.1 46.48,77.97 v47.31,77.15 | v47.31,68.74 47.31,70.27 IC1.8
N$77  (via drill 0.6)
  Top 0.406: v58.74,72.87 59.05,73.18 59.05,75.72 59.53,76.2 63.98,76.2 65.56,74.61 65.56,67.31 63.82,65.56 v63.34,65.56
  Bottom 0.406: R32.1 v58.74,72.87 | v63.34,65.56 63.37,65.59 C2.1
P0.0  (via drill 0.6)
  Top 0.305: v38.1,64.93 36.67,64.93 34.13,62.39 33.66,62.39 32.07,60.8 31.83,60.56 JP1_1.1
  Bottom 0.305: U1_1.3 39.6,66.42 v38.1,64.93
P0.1  (via drill 0.6)
  Top 0.305: v38.1,66.83 38.02,66.83 37.94,66.91 29.69,66.91 29.53,66.75 29.53,64.37 JP1_1.4
  Bottom 0.305: U1_1.26 37.69,66.42 v38.1,66.83
P0.2
  Bottom 0.305: U1_1.25 35.67,65.77 34.37,67.07 33.26,67.07 32.15,68.18 JP1_1.7
P0.3  (via drill 0.6)
  Top 0.305: v11.91,68.98 10.48,68.98 10.16,68.66 10.16,65.56 6.99,62.39 JP1_2.1 | JP1_2.1
  Bottom 0.305: U1_2.3 12.45,68.96 v11.91,68.98
P0.4  (via drill 0.6)
  Top 0.305: v34.77,64.77 34.77,64.69 31.91,61.83 29.53,61.83 JP1_1.2
  Bottom 0.305: U1_1.23 35.06,64.47 v34.77,64.77
P0.5  (via drill 0.6)
  Top 0.406: JP1_2.4 | JP1_2.4 5.08,66.2 5.08,68.42 5.4,68.74 7.7,68.74 v8.57,69.61
  Bottom 0.305: U1_2.26 10.17,68.98 9.21,68.98 v8.57,69.61
P0.6
  Bottom 0.305: U1_1.20 33.04,62.53 32.38,63.18 32.38,63.58 31.59,64.37 30.16,64.37 29.53,65.01 29.53,66.91 JP1_1.8
P0.7
  Bottom 0.305: U1_2.25 7.88,68.31 7.78,68.42 6.51,69.69 6.35,69.85 JP1_2.7 | JP1_2.7
P0.8  (via drill 0.6)
  Top 0.305: v8.73,67.31 8.73,65.25 7.14,63.66 5.08,63.66 JP1_2.2
  Bottom 0.305: U1_2.23 9.19,67.02 v8.73,67.31
P0.9
  Bottom 0.305: U1_2.20 8.12,65.06 6.99,66.2 5.4,66.2 5.08,66.52 5.08,68.74 JP1_2.8
P0_1
  Bottom 0.305: U1_2.22 9.37,66.36 9.14,66.13 8.33,66.13 6.99,67.47 JP1_2.5 | JP1_2.5
P0_5
  Bottom 0.305: U1_1.22 35.72,63.82 35.41,63.51 33.66,63.51 33.34,63.82 33.26,63.9 31.43,65.72 30.8,65.72 JP1_1.5
PROG_1  (via drill 0.6)
  Top 0.406: v23.02,74.93 43.02,74.93 43.97,73.98 43.97,67.47 v44.77,66.67
  Bottom 0.305: U1_1.4 44.03,65.77 44.77,66.52
  Bottom 0.406: 18.69,82.87 S1_1.4 18.89,78.1 20.8,78.1 20.95,77.95 20.95,76.52 22.38,75.09 v23.02,74.93 | 18.69,82.87 S1_1.3 | LED1_1.K 18.64,82.82 18.69,82.87 | v44.77,66.67 44.77,66.52
PROG_2
  Bottom 0.305: U1_2.4 17.28,68.31 17.38,68.42 17.38,70.96 12.06,70.96 10.79,72.23 10.79,77.79 11.27,78.26 13.02,78.26 S1_2.3
  Bottom 0.406: LED1_2.K 6.71,82.82 7.62,81.91 10.17,81.91 S1_2.4 S1_2.3
PWM_1  (via drill 0.8)
  Bottom 0.305: U1_1.12 43.25,60.58 46.2,57.63 47.81,57.63 R20_1.2
  Bottom 0.406: 46.2,57.63 46.04,57.63 v45.88,57.79
PWM_2  (via drill 0.6, 0.8)
  Top 0.305: v14.61,62.39 14.61,63.74 13.18,65.17 13.18,66.99 14.76,68.58 14.76,72.07 14.61,72.07 v14.13,72.23
  Bottom 0.305: U1_2.12 15.33,63.12 v14.61,62.39 | v14.13,72.23 17.97,72.23 R20_2.2
RST
  Bottom 0.305: U1_1.6 44.27,64.47 45.24,63.5 JP11_1.3
RST1
  Bottom 0.305: U1_2.6 17.92,67.02 19.37,65.56 JP11_2.3
VCC  (via drill 0.6, 0.8)  (1 unrouted)
  Top 0.305: v56.67,63.5 v56.67,61.12
  Top 0.406: v56.67,63.5 v64.93,63.5 | v56.67,68.74 v53.98,68.74 49.53,68.74 47.94,67.15 JP11_1.1 | v45.09,68.74 45.56,68.74 45.56,68.42
  Top 0.61: v15.88,73.66 14.76,73.66 8.41,73.66 4.92,77.15 2.06,77.15 v1.91,77.31
  Top 0.813: 45.56,68.42 JP11_1.1
  Bottom 0.305: R20_1.1 54.45,57.79 56.67,60.01 v56.67,61.12
  Bottom 0.406: 30.16,81.91 C9.+ 30.16,81.6 | v53.98,68.74 51.15,68.74 R25.2 | 25.4,77.99 29.96,81.8 | R6.2 64.93,63.38 v64.93,63.5 | R10.2 61.76,71.28 57.15,71.28 56.67,70.8 v56.67,68.74 56.67,66.36 | R9.1 58.58,66.52 58.42,66.36 56.67,66.36 | 20,69.37 20,69.21 | 15.88,74.77 16.19,75.09 20.8,75.09 21.24,74.64 R20_2.1 21.27,73 22.73,73 23.18,72.55 | 56.67,66.36 v56.67,63.5
  Bottom 0.61: v15.88,73.66 15.88,74.77 R4_1.1 | v1.91,77.31 R4_2.1
  Bottom 0.813: 29.96,81.8 29.96,78.79 32.7,76.04 32.7,70.33 34.29,68.74 v45.09,68.74 | L1.1 25.33,74.7 23.18,72.55 20,69.37 | 20,69.21 JP11_2.1
  Bottom 1.27: C9.+ 25.4,77.99 L1.1
VCC_LPC  (via drill 0.6)
  Top 0.305: v40.16,65.41 46.2,65.41 46.83,64.77 49.21,64.77 JP11_1.2
  Bottom 0.305: U1_1.21 37.93,63.18 v40.16,65.41
  Bottom 0.406: C4_1.2 53.18,65.88 53.02,66.04 JP11_1.2
VCC_LPC1  (via drill 0.6)
  Top 0.305: v14.29,65.72 14.29,66.52 15.72,67.94 18.26,67.94 19.37,66.83 21.27,66.83 JP11_2.2
  Bottom 0.305: U1_2.21 v14.28,65.71 v14.29,65.72 | JP11_2.2 24.58,68.1 C4_2.2

### Text on the board
Top: + | - | PWM2 | PWM1 | +24
tPlace: bus + | bus -